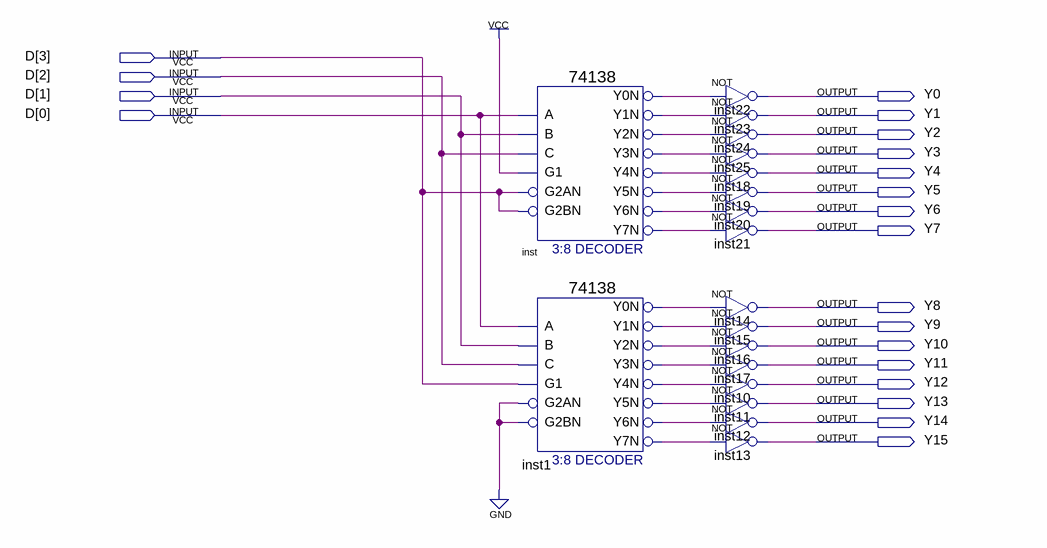
[diagram p0: schematic sheet]
// Quartus schematic 4_16.bdf as structural Verilog: 18 symbols, 20 pins
module \4_16  (
  input  [3:0] D,
  output Y0,
  output Y1,
  output Y2,
  output Y3,
  output Y4,
  output Y5,
  output Y6,
  output Y7,
  output Y8,
  output Y9,
  output Y10,
  output Y11,
  output Y12,
  output Y13,
  output Y14,
  output Y15
);

  wire inst1_y0n, inst1_y1n, inst1_y2n, inst1_y3n, inst1_y4n, inst1_y5n, inst1_y6n, inst1_y7n, inst_y0n,
       inst_y1n, inst_y2n, inst_y3n, inst_y4n, inst_y5n, inst_y6n, inst_y7n;

  \74138  inst (
    .A(D[0]), .B(D[1]), .G1(1'b1), .C(D[2]), .G2AN(D[3]), .G2BN(D[3]), .Y0N(inst_y0n), .Y1N(inst_y1n),
    .Y2N(inst_y2n), .Y3N(inst_y3n), .Y4N(inst_y4n), .Y5N(inst_y5n), .Y6N(inst_y6n), .Y7N(inst_y7n));
  \74138  inst1 (
    .A(D[0]), .B(D[1]), .G1(D[3]), .C(D[2]), .G2AN(1'b0), .G2BN(1'b0), .Y0N(inst1_y0n), .Y1N(inst1_y1n),
    .Y2N(inst1_y2n), .Y3N(inst1_y3n), .Y4N(inst1_y4n), .Y5N(inst1_y5n), .Y6N(inst1_y6n), .Y7N(inst1_y7n));
  not inst22 (Y0, inst_y0n);
  not inst23 (Y1, inst_y1n);
  not inst24 (Y2, inst_y2n);
  not inst25 (Y3, inst_y3n);
  not inst18 (Y4, inst_y4n);
  not inst19 (Y5, inst_y5n);
  not inst20 (Y6, inst_y6n);
  not inst21 (Y7, inst_y7n);
  not inst14 (Y8, inst1_y0n);
  not inst15 (Y9, inst1_y1n);
  not inst16 (Y10, inst1_y2n);
  not inst17 (Y11, inst1_y3n);
  not inst10 (Y12, inst1_y4n);
  not inst11 (Y13, inst1_y5n);
  not inst12 (Y14, inst1_y6n);
  not inst13 (Y15, inst1_y7n);
endmodule
